# EAGLE schematic adk2012_base (EAGLE 5.11)
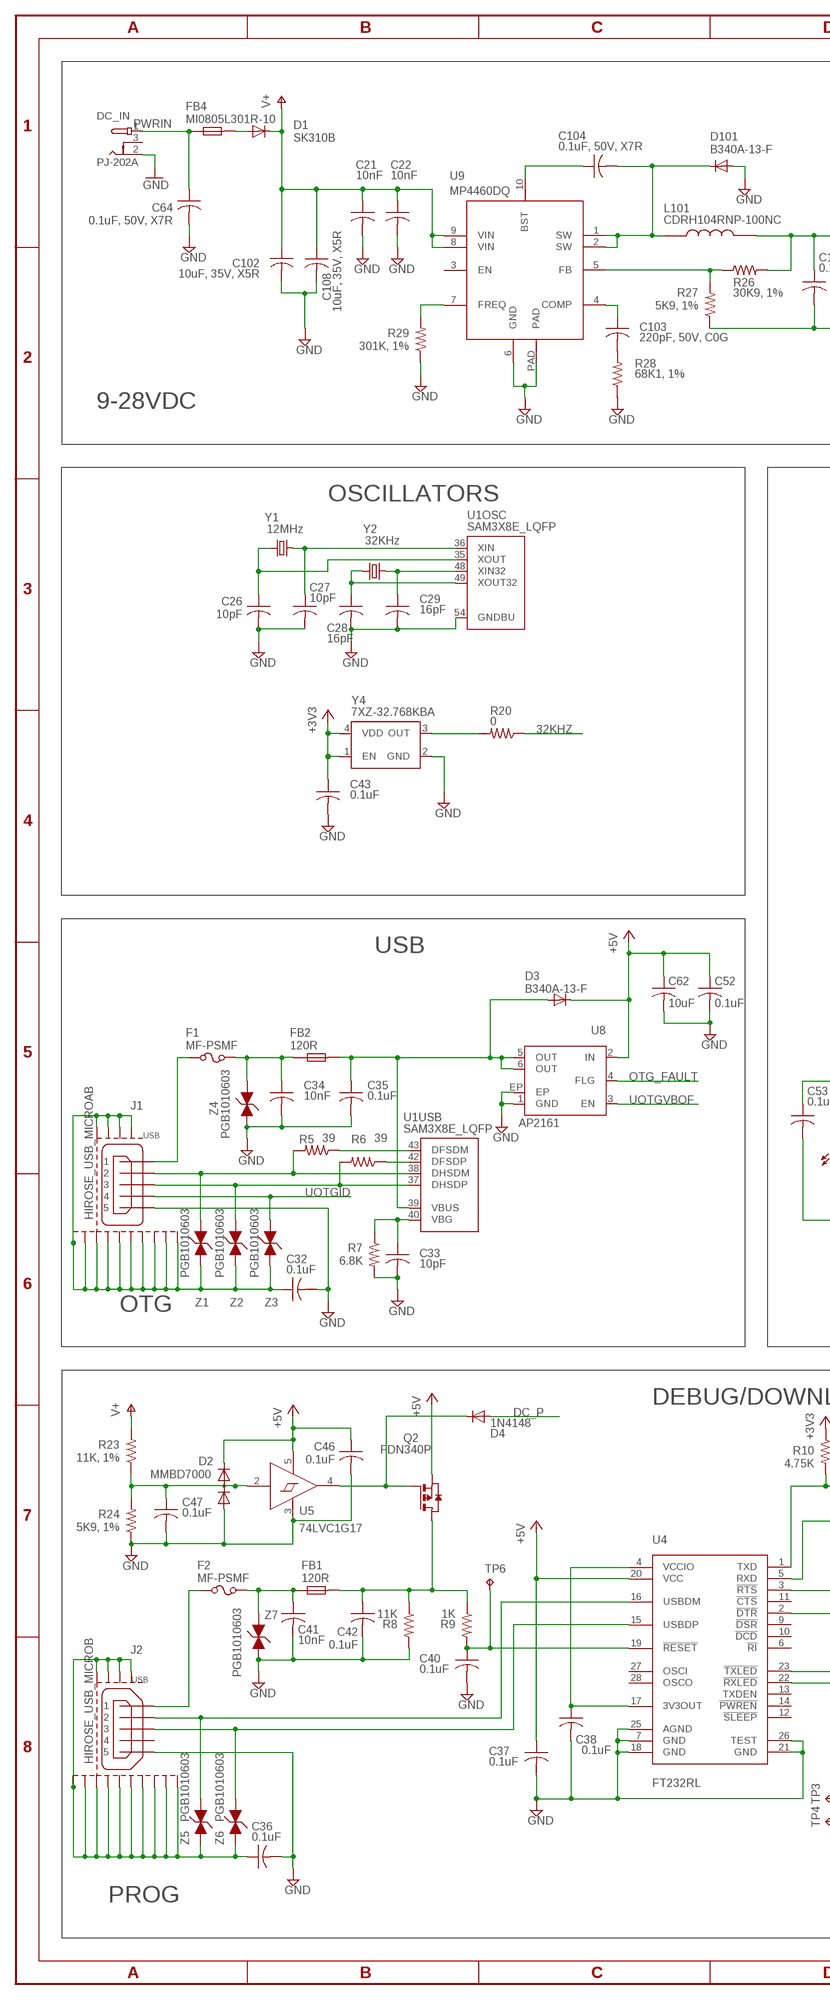
[diagram p0: schematic, sheet 1, part 1 of 2]
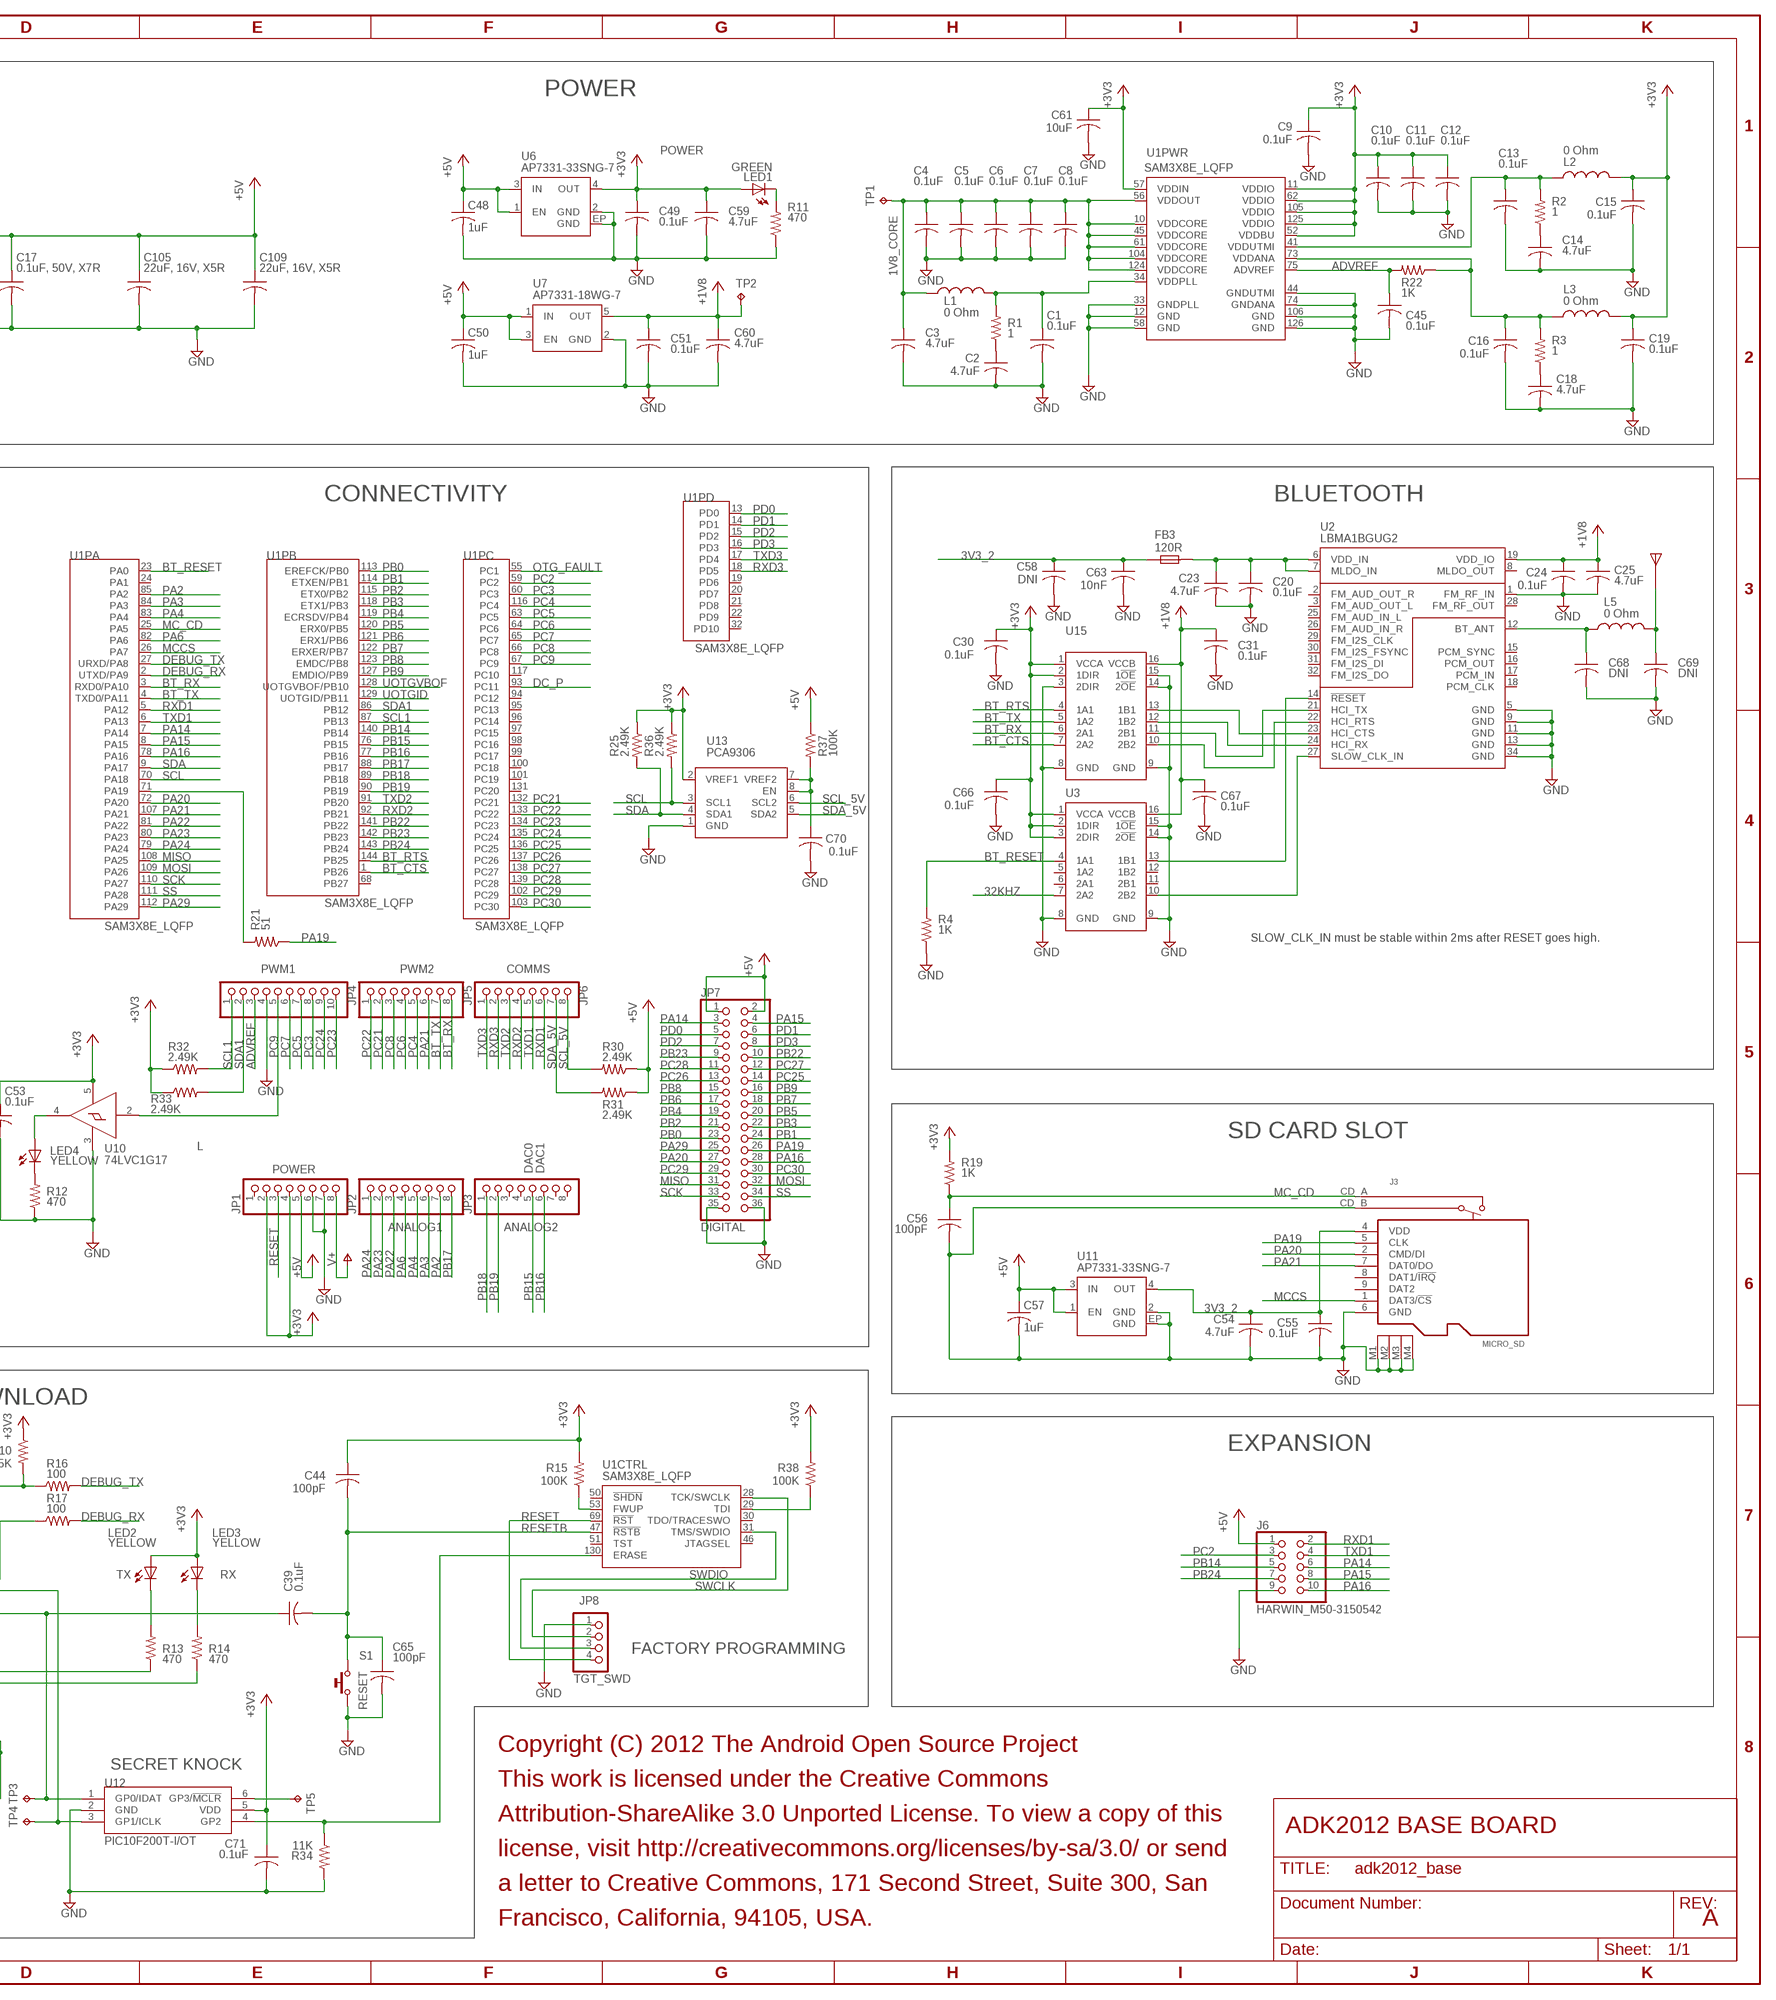
[diagram p1: schematic, sheet 1, part 2 of 2]

## Parts
C1  0.1uF  C-USC0402U  [C0402U]
C2  4.7uF  C-USC0402U  [C0402U]
C3  4.7uF  C-USC0402U  [C0402U]
C4  0.1uF  C-USC0402U  [C0402U]
C5  0.1uF  C-USC0402U  [C0402U]
C6  0.1uF  C-USC0402U  [C0402U]
C7  0.1uF  C-USC0402U  [C0402U]
C8  0.1uF  C-USC0402U  [C0402U]
C9  0.1uF  C-USC0402U  [C0402U]
C10  0.1uF  C-USC0402U  [C0402U]
C11  0.1uF  C-USC0402U  [C0402U]
C12  0.1uF  C-USC0402U  [C0402U]
C13  0.1uF  C-USC0402U  [C0402U]
C14  4.7uF  C-USC0402U  [C0402U]
C15  0.1uF  C-USC0402U  [C0402U]
C16  0.1uF  C-USC0402U  [C0402U]
C17  0.1uF, 50V, X7R  C-USC0603U  [C0603U]
C18  4.7uF  C-USC0402U  [C0402U]
C19  0.1uF  C-USC0402U  [C0402U]
C20  0.1uF  C-USC0402U  [C0402U]
C21  10nF  C-USC0402U  [C0402U]
C22  10nF  C-USC0402U  [C0402U]
C23  4.7uF  C-USC0402U  [C0402U]
C24  0.1uF  C-USC0402U  [C0402U]
C25  4.7uF  C-USC0402U  [C0402U]
C26  10pF  C-USC0402U  [C0402U]
C27  10pF  C-USC0402U  [C0402U]
C28  16pF  C-USC0402U  [C0402U]
C29  16pF  C-USC0402U  [C0402U]
C30  0.1uF  C-USC0402U  [C0402U]
C31  0.1uF  C-USC0402U  [C0402U]
C32  0.1uF  C-USC0402U  [C0402U]
C33  10pF  C-USC0402U  [C0402U]
C34  10nF  C-USC0402U  [C0402U]
C35  0.1uF  C-USC0402U  [C0402U]
C36  0.1uF  C-USC0402U  [C0402U]
C37  0.1uF  C-USC0402U  [C0402U]
C38  0.1uF  C-USC0402U  [C0402U]
C39  0.1uF  C-USC0402U  [C0402U]
C40  0.1uF  C-USC0402U  [C0402U]
C41  10nF  C-USC0402U  [C0402U]
C42  0.1uF  C-USC0402U  [C0402U]
C43  0.1uF  C-USC0402U  [C0402U]
C44  100pF  C-USC0402U  [C0402U]
C45  0.1uF  C-USC0402U  [C0402U]
C46  0.1uF  C-USC0402U  [C0402U]
C47  0.1uF  C-USC0402U  [C0402U]
C48  1uF  C-USC0402  [C0402]
C49  0.1uF  C-USC0402U  [C0402U]
C50  1uF  C-USC0402U  [C0402U]
C51  0.1uF  C-USC0402U  [C0402U]
C52  0.1uF  C-USC0402U  [C0402U]
C53  0.1uF  C-USC0402U  [C0402U]
C54  4.7uF  C-USC0402U  [C0402U]
C55  0.1uF  C-USC0402U  [C0402U]
C56  100pF  C-USC0402U  [C0402U]
C57  1uF  C-USC0402U  [C0402U]
C58  DNI  C-USC0805U  [C0805U]
C59  4.7uF  C-USC0402U  [C0402U]
C60  4.7uF  C-USC0402U  [C0402U]
C61  10uF  C-USC0603U  [C0603U]
C62  10uF  C-USC0603U  [C0603U]
C63  10nF  C-USC0402U  [C0402U]
C64  0.1uF, 50V, X7R  C-USC0603U  [C0603U]
C65  100pF  C-USC0402U  [C0402U]
C66  0.1uF  C-USC0402U  [C0402U]
C67  0.1uF  C-USC0402U  [C0402U]
C68  DNI  C-USC0402U  [C0402U]
C69  DNI  C-USC0402U  [C0402U]
C70  0.1uF  C-USC0402U  [C0402U]
C71  0.1uF  C-USC0402U  [C0402U]
C102  10uF, 35V, X5R  C-USC1210U  [C1210U]
C103  220pF, 50V, C0G  C-USC0603U  [C0603U]
C104  0.1uF, 50V, X7R  C-USC0603R  [C0603R]
C105  22uF, 16V, X5R  C-USC1210U  [C1210U]
C108  10uF, 35V, X5R  C-USC1210U  [C1210U]
C109  22uF, 16V, X5R  C-USC1210U  [C1210U]
D1  SK310B  DIODE-SMB  [SMB]
D2  MMBD7000  BAV199  [SOT23]
D3  B340A-13-F  DIODE-SMA  [SMA]
D4  1N4148  DIODE-SOD323-R  [SOD323-R]
D101  B340A-13-F  DIODE-SMA  [SMA]
DC_IN  PJ-202A  [DC21]
F1  MF-PSMF  [MF-PSMF]
F2  MF-PSMF  [MF-PSMF]
FB1  120R  FERRITE0603  [FB0603]
FB2  120R  FERRITE0603  [FB0603]
FB3  120R  FERRITE0603  [FB0603]
FB4  MI0805L301R-10  FERRITE0805  [FB0805]
J1  HIROSE_USB_MICROAB  [HIROSE_ZX62D-AB-5P8]
J2  HIROSE_USB_MICROB  [HIROSE_ZX62D-B-5P8]
J3  MICRO_SD  [DM3AT]
J6  HARWIN_M50-3150542  [HARWIN_M50-3150542]
JP1  POWER  PINHD-1X8  [1X08]
JP2  ANALOG1  PINHD-1X8  [1X08]
JP3  ANALOG2  PINHD-1X8  [1X08]
JP4  PWM1  PINHD-1X10  [1X10]
JP5  PWM2  PINHD-1X8  [1X08]
JP6  COMMS  PINHD-1X8  [1X08]
JP7  DIGITAL  PINHD-2X18  [2X18]
JP8  TGT_SWD  PINHD-1X4  [1X04]
L1  0 Ohm  L-USL0603U  [L0603U]
L2  0 Ohm  L-USL0603U  [L0603U]
L3  0 Ohm  L-USL0603U  [L0603U]
L5  0 Ohm  L-USL0603U  [L0603U]
L101  CDRH104RNP-100NC  SLF10145T  [IND10MM]
LED1  GREEN  LED-CHIP0603  [CHIP-LED0603]
LED2  YELLOW  LED-CHIP0603  [CHIP-LED0603]
LED3  YELLOW  LED-CHIP0603  [CHIP-LED0603]
LED4  YELLOW  LED-CHIP0603  [CHIP-LED0603]
Q2  FDN340P  PMOSSOT23  [SOT-23]
R1  1  R-US_R0402U  [R0402U]
R2  1  R-US_R0402U  [R0402U]
R3  1  R-US_R0402U  [R0402U]
R4  1K  R-US_R0402U  [R0402U]
R5  39  R-US_R0402U  [R0402U]
R6  39  R-US_R0402U  [R0402U]
R7  6.8K  R-US_R0402U  [R0402U]
R8  11K  R-US_R0402U  [R0402U]
R9  1K  R-US_R0402U  [R0402U]
R10  4.75K  R-US_R0402U  [R0402U]
R11  470  R-US_R0402U  [R0402U]
R12  470  R-US_R0402U  [R0402U]
R13  470  R-US_R0402U  [R0402U]
R14  470  R-US_R0402U  [R0402U]
R15  100K  R-US_R0402U  [R0402U]
R16  100  R-US_R0402U  [R0402U]
R17  100  R-US_R0402U  [R0402U]
R19  1K  R-US_R0402U  [R0402U]
R20  0  R-US_R0402U  [R0402U]
R21  51  R-US_R0402U  [R0402U]
R22  1K  R-US_R0402U  [R0402U]
R23  11K, 1%  R-US_R0402U  [R0402U]
R24  5K9, 1%  R-US_R0402U  [R0402U]
R25  2.49K  R-US_R0402U  [R0402U]
R26  30K9, 1%  R-US_R0402U  [R0402U]
R27  5K9, 1%  R-US_R0402U  [R0402U]
R28  68K1, 1%  R-US_R0402U  [R0402U]
R29  301K, 1%  R-US_R0402U  [R0402U]
R30  2.49K  R-US_R0402U  [R0402U]
R31  2.49K  R-US_R0402U  [R0402U]
R32  2.49K  R-US_R0402U  [R0402U]
R33  2.49K  R-US_R0402U  [R0402U]
R34  11K  R-US_R0402U  [R0402U]
R36  2.49K  R-US_R0402U  [R0402U]
R37  100K  R-US_R0402U  [R0402U]
R38  100K  R-US_R0402U  [R0402U]
S1  RESET  SWITCH_CK_KSS  [CK_KSS]
TP1  TPTP10R  [TP10R]
TP2  TPTP10R  [TP10R]
TP3  TPTP10R  [TP10R]
TP4  TPTP10R  [TP10R]
TP5  TPTP10R  [TP10R]
TP6  TPTP10R  [TP10R]
U1  SAM3X8E_LQFP  [LQFP-144]
U2  LBMA1BGUG2  [LBMA1BGUG2]
U3  SN74AVC4T245  [TSSOP16]
U4  FT232RL  [SSOP-28]
U5  74LVC1G17  [SOT-553]
U6  AP7331-33SNG-7  AP7331  [AP7331]
U7  AP7331-18WG-7  AP7331-SOT  [SOT23-5]
U8  AP2161  [DFN2018-6]
U9  MP4460DQ  [DFN-10]
U10  74LVC1G17  [SOT-553]
U11  AP7331-33SNG-7  AP7331  [AP7331]
U12  PIC10F200T-I/OT  PIC10F20X  [SOT23-6]
U13  PCA9306  [TSSOP8]
U15  SN74AVC4T245  [TSSOP16]
U$2  BT_ANT  [BT_ANT]
U$11  USB_LOGO  [USB_LOGO_SILK]
U$14  USB_LOGO  [USB_LOGO_SILK]
Y1  12MHz  XTAL5032  [XTAL5032]
Y2  32KHz  ABS07  [ABS07]
Y4  7XZ-32.768KBA  CXO_7XZ  [Y32X25]
Z1  PGB1010603  [V0603]
Z2  PGB1010603  [V0603]
Z3  PGB1010603  [V0603]
Z4  PGB1010603  [V0603]
Z5  PGB1010603  [V0603]
Z6  PGB1010603  [V0603]
Z7  PGB1010603  [V0603]

## Nets
1V8_CORE: C3.1 C4.1 C5.1 C6.1 C7.1 C8.1 L1.1 TP1.TP U1.10(PWR:VDDCORE) U1.45(PWR:VDDCORE) U1.56(PWR:VDDOUT) U1.61(PWR:VDDCORE) U1.104(PWR:VDDCORE) U1.124(PWR:VDDCORE)
3V3_2: C54.1 C55.1 C58.1 C63.1 FB3.1 J3.4(VDD) U11.4(OUT)
32KHZ: R20.1 U3.7(2A2)
+1V8: C24.1 C25.1 C31.1 C51.1 C60.1 C67.1 TP2.TP U2.19(VDD_IO) U3.16(VCCB) U7.5(OUT) U15.16(VCCB)
+3V3: C9.1 C10.1 C11.1 C12.1 C15.1 C19.1 C30.1 C43.1 C44.1 C49.1 C53.1 C59.1 C61.1 C66.1 C71.1 JP1.2 JP1.4 L2.2 L3.2 LED1.A LED2.A LED3.A R10.1 R15.2 R19.2 R25.1 R32.1 R33.1 R36.1 R38.2 U1.11(PWR:VDDIO) U1.52(PWR:VDDBU) U1.57(PWR:VDDIN) U1.62(PWR:VDDIO) U1.105(PWR:VDDIO) U1.125(PWR:VDDIO) U3.1(VCCA) U3.2(1DIR) U3.3(2DIR) U6.4(OUT) U10.5(VCC) U12.5(VDD) U13.2(VREF1) U15.1(VCCA) U15.2(1DIR) Y4.1(EN) Y4.4(VDD)
+5V: C17.1 C37.1 C46.1 C48.1 C50.1 C52.1 C57.1 C62.1 C105.1 C109.1 D2.2(C) D3.K(C) J6.1 JP1.5 JP7.1 JP7.2 L101.P$2 Q2.2(S) R26.2 R30.1 R31.1 R37.1 U4.20(VCC) U5.5(VCC) U6.1(EN) U6.3(IN) U7.1(IN) U7.3(EN) U8.2(IN) U11.1(EN) U11.3(IN)
ADVREF: C45.1 JP4.3 R22.2 U1.75(PWR:ADVREF)
BT_CTS: U1.1(PB:PB26) U15.7(2A2)
BT_RESET: R4.2 U1.23(PA:PA0) U3.4(1A1)
BT_RTS: U1.144(PB:PB25) U15.4(1A1)
BT_RX: JP5.8 U1.3(PA:RXD0/PA10) U15.6(2A1)
BT_TX: JP5.7 U1.4(PA:TXD0/PA11) U15.5(1A2)
DC_P: D4.A U1.93(PC:PC11)
DC_P1: D4.C Q2.3(G) U5.4(Y)
DEBUG_RX: R17.2 U1.2(PA:UTXD/PA9)
DEBUG_RX1: R17.1 U4.5(RXD)
DEBUG_TX: R16.2 U1.27(PA:URXD/PA8)
DEBUG_TX1: R10.2 R16.1 U4.1(TXD)
ERASE: TP4.TP U4.3(!RTS) U12.3(GP1/ICLK)
GND: C1.2 C2.2 C3.2 C4.2 C5.2 C6.2 C7.2 C8.2 C9.2 C10.2 C11.2 C12.2 C13.2 C14.2 C15.2 C16.2 C17.2 C18.2 C19.2 C20.2 C21.2 C22.2 C23.2 C24.2 C25.2 C26.2 C27.2 C28.2 C29.2 C30.2 C31.2 C32.2 C33.2 C34.2 C35.2 C36.2 C37.2 C38.2 C40.2 C41.2 C42.2 C43.2 C45.2 C46.2 C47.2 C48.2 C49.2 C50.2 C51.2 C52.2 C53.2 C54.2 C55.2 C56.2 C57.2 C58.2 C59.2 C60.2 C61.2 C62.2 C63.2 C64.2 C65.2 C66.2 C67.2 C68.2 C69.2 C70.2 C71.2 C102.2 C105.2 C108.2 C109.2 D2.1(A) D101.A DC_IN.2 J1.5 J2.5 J3.6(GND) J3.CD_B J3.M1 J3.M2 J3.M3 J3.M4 J6.9 JP1.6 JP1.7 JP4.4 JP7.35 JP7.36 JP8.1 R4.1 R7.2 R8.2 R11.1 R12.1 R24.1 R27.1 R28.1 R29.1 R34.2 S1.P$1 U1.12(PWR:GND) U1.33(PWR:GNDPLL) U1.44(PWR:GNDUTMI) U1.54(OSC:GNDBU) U1.58(PWR:GND) U1.74(PWR:GNDANA) U1.106(PWR:GND) U1.126(PWR:GND) U2.1(FM_RF_IN) U2.5(GND) U2.9(GND) U2.11(GND) U2.13(GND) U2.34(GND) U3.8(GND) U3.9(GND) U3.14(2!OE) U3.15(1!OE) U4.7(GND) U4.18(GND) U4.21(GND) U4.25(AGND) U4.26(TEST) U5.3(GND) U6.2(GND) U6.EP(GND) U7.2(GND) U8.1(GND) U8.EP U9.6(GND) U9.PAD U10.3(GND) U11.2(GND) U11.EP(GND) U12.2(GND) U13.1(GND) U15.3(2DIR) U15.8(GND) U15.9(GND) U15.14(2!OE) U15.15(1!OE) Y4.2(GND) Z4.1 Z7.1
MC_CD: C56.1 J3.CD_A R19.1 U1.25(PA:PA5)
MCCS: J3.1(DAT3/!CS) U1.26(PA:PA7)
MISO: JP7.31 U1.108(PA:PA25)
MOSI: JP7.32 U1.109(PA:PA26)
N$1: C20.1 C23.1 FB3.2 U2.6(VDD_IN) U2.7(MLDO_IN)
N$2: C1.1 L1.2 R1.2 U1.34(PWR:VDDPLL)
N$3: C14.1 R2.1
N$4: C69.1 L5.2 U$2.1
N$5: C27.1 U1.36(OSC:XIN) Y1.2
N$6: C2.1 R1.1
N$7: C13.1 L2.1 R2.2 U1.41(PWR:VDDUTMI)
N$8: C26.1 U1.35(OSC:XOUT) Y1.1
N$9: C28.1 U1.49(OSC:XOUT32) Y2.1
N$10: C29.1 U1.48(OSC:XIN32) Y2.2
N$11: C18.1 R3.1
N$12: C104.1 U9.10(BST)
N$14: C16.1 L3.1 R3.2 R22.1 U1.73(PWR:VDDANA)
N$15: C104.2 D101.K(C) L101.P$1 U9.1(SW) U9.2(SW)
N$16: D1.A FB4.2
N$17: U2.21(HCI_TX) U15.11(2B1)
N$18: R29.2 U9.7(FREQ)
N$19: U2.23(HCI_CTS) U15.13(1B1)
N$20: U2.22(HCI_RTS) U15.10(2B2)
N$21: U2.24(HCI_RX) U15.12(1B2)
N$22: R21.2 U1.71(PA:PA19)
N$23 [USB]: J1.2 R5.2 U1.38(USB:DHSDM) Z1.2
N$24: R5.1 U1.43(USB:DFSDM)
N$25: R6.1 U1.42(USB:DFSDP)
N$26: R26.1 R27.2 U9.5(FB)
N$27: C103.1 U9.4(COMP)
N$28 [USB]: J1.3 R6.2 U1.37(USB:DHSDP) Z2.2
N$29: C32.1 J1.M1(GND1) J1.M2(GND2) J1.M3(GND3) J1.M4(GND4) J1.M5(GND5) J1.M6(GND6) J1.M7(GND7) J1.M8(GND8) J1.M9(GND9) J1.M10(GND10) J1.M11(GND11) J1.M12(GND12) J1.M13(GND13) J1.M14(GND14) Z1.1 Z2.1 Z3.1
N$30: C33.1 R7.1 U1.40(USB:VBG)
N$31: F1.1 J1.1
N$32: C42.1 FB1.2 Q2.1(D) R8.1 R9.1
N$33: C103.2 R28.2
N$34: C34.1 F1.2 FB2.1 Z4.2
N$35: J2.2 U4.16(USBDM) Z5.2
N$36: C35.1 D3.A FB2.2 U1.39(USB:VBUS) U8.5(OUT) U8.6(OUT)
N$37: J2.3 U4.15(USBDP) Z6.2
N$38: C36.1 J2.M1(GND1) J2.M2(GND2) J2.M3(GND3) J2.M4(GND4) J2.M5(GND5) J2.M6(GND6) J2.M7(GND7) J2.M8(GND8) J2.M9(GND9) J2.M10(GND10) J2.M11(GND11) J2.M12(GND12) J2.P$1(GND13) J2.P$2(GND14) Z5.1 Z6.1
N$39: F2.1 J2.1
N$40 [USB]: C68.1 L5.1 U2.12(BT_ANT)
N$41: C41.1 F2.2 FB1.1 Z7.2
N$42: R34.1 U1.130(CTRL:ERASE) U12.4(GP2)
N$43: C39.1 TP3.TP U4.2(!DTR) U12.1(GP0/IDAT)
N$44: C40.1 R9.2 TP6.TP U4.19(!RESET)
N$45: LED1.C R11.2
N$46: R13.1 U4.23(!TXLED)
N$47: R14.1 U4.22(!RXLED)
N$48: TP5.TP U12.6(GP3/!MCLR)
N$50: C38.1 U4.4(VCCIO) U4.17(3V3OUT)
N$51: LED4.A U10.4(Y)
N$52: LED3.C R14.2
N$53: LED2.C R13.2
N$56: R15.1 U1.53(CTRL:FWUP)
N$61: R38.1 U1.29(CTRL:TDI)
N$63: C47.1 D2.3(AC) R23.1 R24.2 U5.2(A)
N$65: LED4.C R12.2
N$66: U2.14(!RESET) U3.13(1B1)
N$67: U2.27(SLOW_CLK_IN) U3.10(2B2)
N$72: R20.2 Y4.3(OUT)
N$77: C70.1 R37.2 U13.7(VREF2) U13.8(EN)
OTG_FAULT: U1.55(PC:PC1) U8.4(FLG)
PA2: JP2.7 U1.85(PA:PA2)
PA3: JP2.6 U1.84(PA:PA3)
PA4: JP2.5 U1.83(PA:PA4)
PA6: JP2.4 U1.82(PA:PA6)
PA14: J6.6 JP7.3 U1.7(PA:PA14)
PA15: J6.8 JP7.4 U1.8(PA:PA15)
PA16: J6.10 JP7.28 U1.78(PA:PA16)
PA19: J3.5(CLK) JP7.26 R21.1
PA20: J3.2(CMD/DI) JP7.27 U1.72(PA:PA20)
PA21: J3.7(DAT0/DO) JP5.6 U1.107(PA:PA21)
PA22: JP2.3 U1.81(PA:PA22)
PA23: JP2.2 U1.80(PA:PA23)
PA24: JP2.1 U1.79(PA:PA24)
PA29: JP7.25 U1.112(PA:PA29)
PB0: JP7.23 U1.113(PB:EREFCK/PB0)
PB1: JP7.24 U1.114(PB:ETXEN/PB1)
PB2: JP7.21 U1.115(PB:ETX0/PB2)
PB3: JP7.22 U1.118(PB:ETX1/PB3)
PB4: JP7.19 U1.119(PB:ECRSDV/PB4)
PB5: JP7.20 U1.120(PB:ERX0/PB5)
PB6: JP7.17 U1.121(PB:ERX1/PB6)
PB7: JP7.18 U1.122(PB:ERXER/PB7)
PB8: JP7.15 U1.123(PB:EMDC/PB8)
PB9: JP7.16 U1.127(PB:EMDIO/PB9)
PB14: J6.5 U1.140(PB:PB14)
PB15: JP3.5 U1.76(PB:PB15)
PB16: JP3.6 U1.77(PB:PB16)
PB17: JP2.8 U1.88(PB:PB17)
PB18: JP3.1 U1.89(PB:PB18)
PB19: JP3.2 U1.90(PB:PB19)
PB22: JP7.10 U1.141(PB:PB22)
PB23: JP7.9 U1.142(PB:PB23)
PB24: J6.7 U1.143(PB:PB24)
PC2: J6.3 U1.59(PC:PC2)
PC3: JP4.8 U1.60(PC:PC3)
PC4: JP5.5 U1.116(PC:PC4)
PC5: JP4.7 U1.63(PC:PC5)
PC6: JP5.4 U1.64(PC:PC6)
PC7: JP4.6 U1.65(PC:PC7)
PC8: JP5.3 U1.66(PC:PC8)
PC9: JP4.5 U1.67(PC:PC9) U10.2(A)
PC21: JP5.2 U1.132(PC:PC21)
PC22: JP5.1 U1.133(PC:PC22)
PC23: JP4.10 U1.134(PC:PC23)
PC24: JP4.9 U1.135(PC:PC24)
PC25: JP7.14 U1.136(PC:PC25)
PC26: JP7.13 U1.137(PC:PC26)
PC27: JP7.12 U1.138(PC:PC27)
PC28: JP7.11 U1.139(PC:PC28)
PC29: JP7.29 U1.102(PC:PC29)
PC30: JP7.30 U1.103(PC:PC30)
PD0: JP7.5 U1.13(PD:PD0)
PD1: JP7.6 U1.14(PD:PD1)
PD2: JP7.7 U1.15(PD:PD2)
PD3: JP7.8 U1.16(PD:PD3)
PWRIN: C64.1 DC_IN.1 FB4.1
RESET: JP1.3 JP8.4 U1.69(CTRL:!RST)
RESETB: C39.2 C44.2 C65.1 S1.P$2 U1.47(CTRL:!RSTB)
RXD1: J6.2 JP6.6 U1.5(PA:PA12)
RXD2: JP6.4 U1.92(PB:PB21)
RXD3: JP6.2 U1.18(PD:PD5)
SCK: JP7.33 U1.110(PA:PA27)
SCL: R36.2 U1.70(PA:PA18) U13.3(SCL1)
SCL1: JP4.1 R32.2 U1.87(PB:PB13)
SCL_5V: JP6.8 R30.2 U13.6(SCL2)
SDA: R25.2 U1.9(PA:PA17) U13.4(SDA1)
SDA1: JP4.2 R33.2 U1.86(PB:PB12)
SDA_5V: JP6.7 R31.2 U13.5(SDA2)
SS: JP7.34 U1.111(PA:PA28)
SWCLK: JP8.2 U1.28(CTRL:TCK/SWCLK)
SWDIO: JP8.3 U1.31(CTRL:TMS/SWDIO)
TXD1: J6.4 JP6.5 U1.6(PA:PA13)
TXD2: JP6.3 U1.91(PB:PB20)
TXD3: JP6.1 U1.17(PD:PD4)
UOTGID: J1.4 U1.129(PB:UOTGID/PB11) Z3.2
UOTGVBOF: U1.128(PB:UOTGVBOF/PB10) U8.3(EN)
V+: C21.1 C22.1 C102.1 C108.1 D1.C JP1.8 R23.2 U9.8(VIN) U9.9(VIN)
Unconnected: DC_IN.3 J2.4 J3.8(DAT1/!IRQ) J3.9(DAT2) JP1.1 JP3.3 JP3.4 JP3.7 JP3.8 U1.19(PD:PD6) U1.20(PD:PD7) U1.21(PD:PD8) U1.22(PD:PD9) U1.24(PA:PA1) U1.30(CTRL:TDO/TRACESWO) U1.32(PD:PD10) U1.46(CTRL:JTAGSEL) U1.50(CTRL:!SHDN) U1.51(CTRL:TST) U1.68(PB:PB27) U1.94(PC:PC12) U1.95(PC:PC13) U1.96(PC:PC14) U1.97(PC:PC15) U1.98(PC:PC16) U1.99(PC:PC17) U1.100(PC:PC18) U1.101(PC:PC19) U1.117(PC:PC10) U1.131(PC:PC20) U2.2(FM_AUD_OUT_R) U2.3(FM_AUD_OUT_L) U2.8(MLDO_OUT) U2.15(PCM_SYNC) U2.16(PCM_OUT) U2.17(PCM_IN) U2.18(PCM_CLK) U2.25(FM_AUD_IN_L) U2.26(FM_AUD_IN_R) U2.28(FM_RF_OUT) U2.29(FM_I2S_CLK) U2.30(FM_I2S_FSYNC) U2.31(FM_I2S_DI) U2.32(FM_I2S_DO) U3.5(1A2) U3.6(2A1) U3.11(2B1) U3.12(1B2) U4.6(!RI) U4.9(!DSR) U4.10(!DCD) U4.11(!CTS) U4.12(!SLEEP) U4.13(TXDEN) U4.14(!PWREN) U4.27(OSCI) U4.28(OSCO) U9.3(EN)

## Notes on the sheet
- POWER
- POWER
- 9-28VDC
- OSCILLATORS | CONNECTIVITY | BLUETOOTH
- SLOW_CLK_IN must be stable within 2ms after RESET goes high.
- USB
- SD CARD SLOT
- L
- DAC0 | DAC1
- OTG
- DEBUG/DOWNLOAD
- EXPANSION
- TX | RX
- FACTORY PROGRAMMING
- Copyright (C) 2012 The Android Open Source Project
- SECRET KNOCK
- This work is licensed under the Creative Commons
- Attribution-ShareAlike 3.0 Unported License. To view a copy of this
- ADK2012 BASE BOARD
- license, visit http://creativecommons.org/licenses/by-sa/3.0/ or send
- a letter to Creative Commons, 171 Second Street, Suite 300, San
- PROG
- Francisco, California, 94105, USA. | A

## Library data of the parts
C1-C71 C102-C105 C108 C109 = rcl:C-US: CAPACITOR, American symbol
D1 D3 D4 D101 = diode:DIODE-: DIODE
D2 = diode:BAV199: DIODE low-leakage double diode
DC_IN = cui:PJ-202A: CUI Stack 2.1mm DC Power Jack
F1 F2 = adk2:MF-PSMF: Bourns MF-PSMF PTC resettable fuse (0805)
FB1-FB4 = adk2:FERRITE: Ferrite bead
J1 = con-misc:HIROSE_USB_MICROAB: Hirose USB Micro AB (Bottom mount, shell through hole)
J2 = con-misc:HIROSE_USB_MICROB: Hirose USB Micro B (Bottom mount, shell through hole)
J3 = adk2:MICRO_SD: Micro SD card slot
J6 = con-misc:HARWIN_M50-3150542
JP1-JP3 JP5 JP6 = pinhead:PINHD-1X8: PIN HEADER
JP4 = pinhead:PINHD-1X10: PIN HEADER
JP7 = pinhead:PINHD-2X18: PIN HEADER
JP8 = pinhead:PINHD-1X4: PIN HEADER
L1-L3 L5 = rcl:L-US: INDUCTOR, American symbol
L101 = bibaja:SLF10145T: TDK SLF Series SLF10145 Type Inductor Surface mount 10.1 x 10.1 mm inductor, low DC resistance, high current capacity.
LED1-LED4 = adk2:LED-CHIP0603
Q2 = zetex:PMOSSOT23: MOS FET; OC_FARNELL: unknown; OC_NEWARK: unknown
R1-R17 R19-R34 R36-R38 = rcl:R-US_: RESISTOR, American symbol
S1 = adk2:SWITCH_CK_KSS: C&K KSS tact switch, surface mount right angle
TP1-TP6 = testpad:TP: Test pad
U1 = adk2:SAM3X8E_LQFP: Atmel SAM3X8E LQFP-144
U2 = adk2:LBMA1BGUG2
U3 U15 = adk2:SN74AVC4T245: Bidirectional level shifter with direction control pins
U4 = adk2:FT232RL: FTDI USB->232, default config
U5 U10 = bibaja:74LVC1G17: Single Schmitt-Trigger Buffer, 1.65-5.5V (Alternate part NL17SZ17)
U6 U11 = adk2:AP7331: Diodes, Inc AP7331 LDO (300mA) family (fixed output)
U7 = adk2:AP7331-SOT: Diodes, Inc. AP7331 regulator (SOT23-5 package)
U8 = adk2:AP2161: Diodes, Inc. USB switch (1A)
U9 = bibaja:MP4460: MPS DC/DC Switching regulator
U12 = adk2:PIC10F20X: Microchip PIC10F2xx series 6-pin microcontroller
U13 = adk2:PCA9306
U$2 = adk2:BT_ANT
U$11 U$14 = adk2:USB_LOGO: USB Logo (top silk)
Y1 = bibaja:XTAL5032: Crystal, 5.0x3.2mm Oscilent.com 267 Series Kyocera CX5032 Series
Y2 = adk2:ABS07: ABS07 Abracon 3.2mm x 1.5mm crystal
Y4 = adk2:CXO_7XZ
Z1-Z7 = adk2:PGB1010603

## Net classes
0 default: width 0.152 mm, drill 0.305 mm, clearance 0.152 mm
1 USB: width 0.305 mm, drill 0.305 mm, clearance 0.152 mm
2 24V: width 0.203 mm, drill 0.406 mm, clearance 0.254 mm